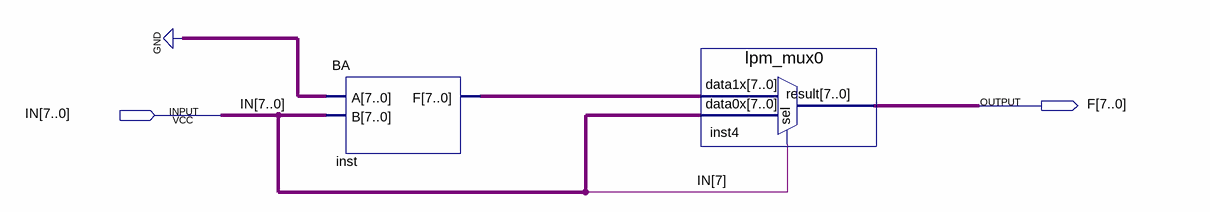
[diagram p0: schematic sheet]
// Quartus schematic ABS.bdf as structural Verilog: 2 symbols, 2 pins
module ABS (
  input  [7:0] IN,
  output [7:0] F
);

  wire [7:0] inst_f;

  BA inst (.A({8{1'b0}}), .B(IN), .F(inst_f));
  lpm_mux0 inst4 (.data1x(inst_f), .data0x(IN), .sel(IN[7]), .result(F));
endmodule
